# EAGLE design Comm_FM (EAGLE 5.11)

## Sheet 1 of 4
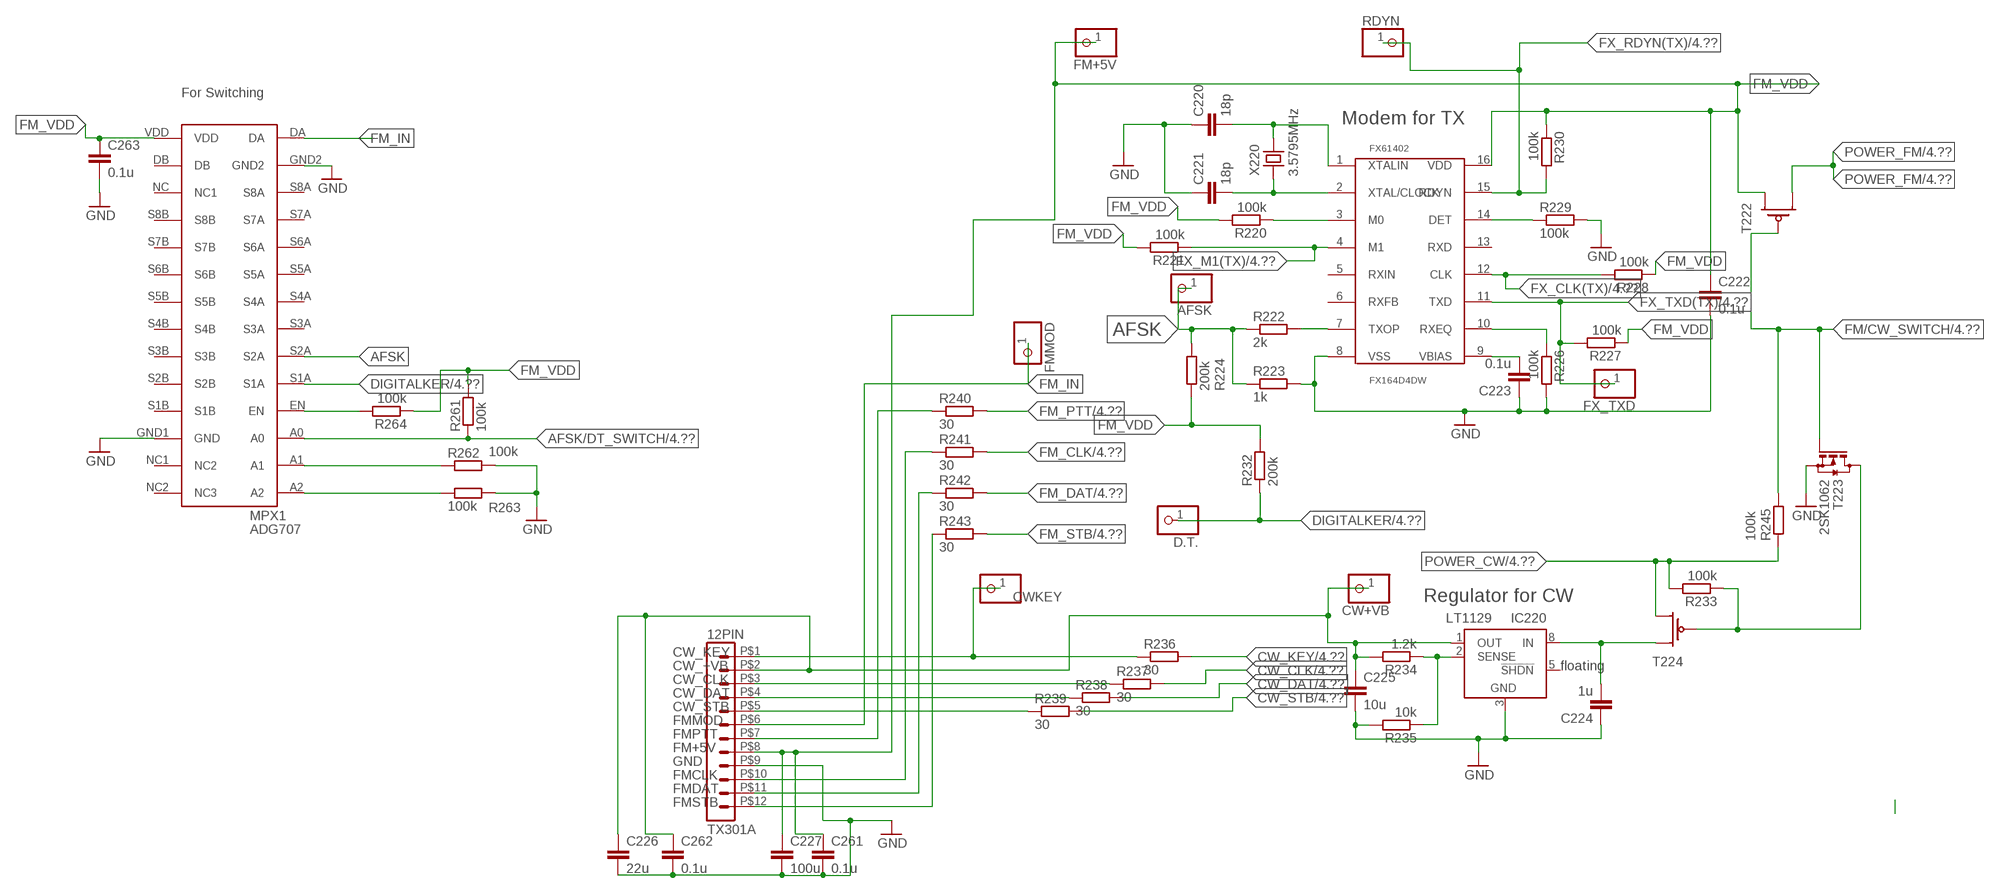
[diagram p0: schematic, sheet 1]

### Parts
AFSK  PINHD-1X1  [1X01]
C220  18p  C-EUC0603  [C0603]
C221  18p  C-EUC0603  [C0603]
C222  0.1u  C-EUC0603  [C0603]
C223  0.1u  C-EUC0603  [C0603]
C224  1u  C-EUC0603  [C0603]
C225  10u  C-EUC0603  [C0603]
C226  22u  C-EUC3225  [C3225]
C227  100u  C-EUC3225  [C3225]
C261  0.1u  C-EUC0603  [C0603]
C262  0.1u  C-EUC0603  [C0603]
C263  0.1u  C-EUC0603  [C0603]
CW+VB  PINHD-1X1  [1X01]
CWKEY  PINHD-1X1  [1X01]
D.T.  PINHD-1X1  [1X01]
FM+5V  PINHD-1X1  [1X01]
FMMOD  PINHD-1X1  [1X01]
FX61402  FX164D4DW  [SO16W]
FX_TXD  PINHD-1X1  [1X01]
IC220  LT1129  LT1129CS8  [SOIC8]
MPX1  ADG707  [ADG707]
R220  100k  R-EU_R0603  [R0603]
R221  100k  R-EU_R0603  [R0603]
R222  2k  R-EU_R0603  [R0603]
R223  1k  R-EU_R0603  [R0603]
R224  200k  R-EU_R0603  [R0603]
R226  100k  R-EU_R0603  [R0603]
R227  100k  R-EU_R0603  [R0603]
R228  100k  R-EU_R0603  [R0603]
R229  100k  R-EU_R0603  [R0603]
R230  100k  R-EU_R0603  [R0603]
R232  200k  R-EU_R0603  [R0603]
R233  100k  R-EU_R0603  [R0603]
R234  1.2k  R-EU_R0603  [R0603]
R235  10k  R-EU_R0603  [R0603]
R236  30  R-EU_R0603  [R0603]
R237  30  R-EU_R0603  [R0603]
R238  30  R-EU_R0603  [R0603]
R239  30  R-EU_R0603  [R0603]
R240  30  R-EU_R0603  [R0603]
R241  30  R-EU_R0603  [R0603]
R242  30  R-EU_R0603  [R0603]
R243  30  R-EU_R0603  [R0603]
R245  100k  R-EU_R0603  [R0603]
R261  100k  R-EU_R0603  [R0603]
R262  100k  R-EU_R0603  [R0603]
R263  100k  R-EU_R0603  [R0603]
R264  100k  R-EU_R0603  [R0603]
RDYN  PINHD-1X1  [1X01]
T222  2SJ377  [2SJ377]
T223  2SK1062  BSS123  [SOT23]
T224  2SJ377  [2SJ377]
TX301A  12PIN  [12PIN]
X220  3.5795MHz  XTAL49S  [HC49/S]

### Nets
AFSK: AFSK.1 MPX1.S2A R222.1 R223.1 R224.2
AFSK/DT_SWITCH: MPX1.A0 R261.1 ; also sheet 4
CW_CLK: R237.2 ; also sheet 4
CW_DAT: R238.2 ; also sheet 4
CW_KEY: R236.2 ; also sheet 4
CW_STB: R239.2 ; also sheet 4
DIGITALKER: D.T..1 MPX1.S1A R232.1 ; also sheet 4
FM/CW_SWITCH: R245.2 T222.G T223.1(G) ; also sheet 4
FM_CLK: R241.2 ; also sheet 4
FM_DAT: R242.2 ; also sheet 4
FM_IN: FMMOD.1 MPX1.DA TX301A.P$6
FM_PTT: R240.2 ; also sheet 4
FM_STB: R243.2 ; also sheet 4
FM_VDD: C222.1 C227.1 C261.1 C263.1 FM+5V.1 FX61402.16(VDD) MPX1.VDD R220.2 R221.2 R224.1 R227.1 R228.1 R230.1 R232.2 R261.2 R264.1 T222.D TX301A.P$8
FX_CLK(TX): FX61402.12(CLK) R228.2 ; also sheet 4
FX_M1(TX): FX61402.4(M1) R221.1 ; also sheet 4
FX_RDYN(TX): FX61402.15(RDYN) R230.2 RDYN.1 ; also sheet 4
FX_TXD(TX): FX61402.11(TXD) FX_TXD.1 R227.2 ; also sheet 4
GND: C220.1 C221.1 C222.2 C223.1 C224.1 C225.2 C226.2 C227.2 C261.2 C262.2 C263.2 FX61402.8(VSS) IC220.3(GND) MPX1.GND1(GND) MPX1.GND2 R223.2 R226.2 R229.2 R235.2 R262.2 R263.2 T223.2(S) TX301A.P$9 ; also sheet 2,3,4
N$6: C220.2 FX61402.1(XTALIN) X220.2
N$8: C221.2 FX61402.2(XTAL/CLOCK) X220.1
N$10: R242.1 TX301A.P$11
N$12: FX61402.7(TXOP) R222.2
N$18: R240.1 TX301A.P$7
N$19: MPX1.A2 R263.1
N$20: R243.1 TX301A.P$12
N$21: R241.1 TX301A.P$10
N$22: C223.2 FX61402.9(VBIAS)
N$26: FX61402.10(RXEQ) R226.1
N$27: FX61402.3(M0) R220.1
N$28: FX61402.14(DET) R229.1
N$36: MPX1.A1 R262.1
N$37: MPX1.EN R264.2
N$38: R233.1 T223.3(D) T224.G
N$39: C224.2 IC220.8(IN) T224.D
N$40: IC220.2(SENSE) R234.1 R235.1
N$43: CWKEY.1 R236.1 TX301A.P$1
N$45: R237.1 TX301A.P$3
N$47: R238.1 TX301A.P$4
N$49: R239.1 TX301A.P$5
N$51: C225.1 C226.1 C262.1 CW+VB.1 IC220.1(OUT) R234.2 TX301A.P$2
POWER_CW: R233.2 R245.1 T224.S ; also sheet 4
POWER_FM: T222.S ; also sheet 4
Unconnected: FX61402.5(RXIN) FX61402.6(RXFB) FX61402.13(RXD) IC220.4(NC) IC220.5(!SHDN) MPX1.DB MPX1.NC1(NC2) MPX1.NC2(NC3) MPX1.NC(NC1) MPX1.S1B MPX1.S2B MPX1.S3A MPX1.S3B MPX1.S4A MPX1.S4B MPX1.S5A MPX1.S5B MPX1.S6A MPX1.S6B MPX1.S7A MPX1.S7B MPX1.S8A MPX1.S8B

### Notes on the sheet
- For Switching
- Modem for TX
- Regulator for CW
- CW_KEY
- CW_+VB | floating
- CW_CLK
- CW_DAT
- CW_STB
- FMMOD
- FMPTT
- FM+5V
- GND
- FMCLK
- FMDAT
- FMSTB

## Sheet 2 of 4
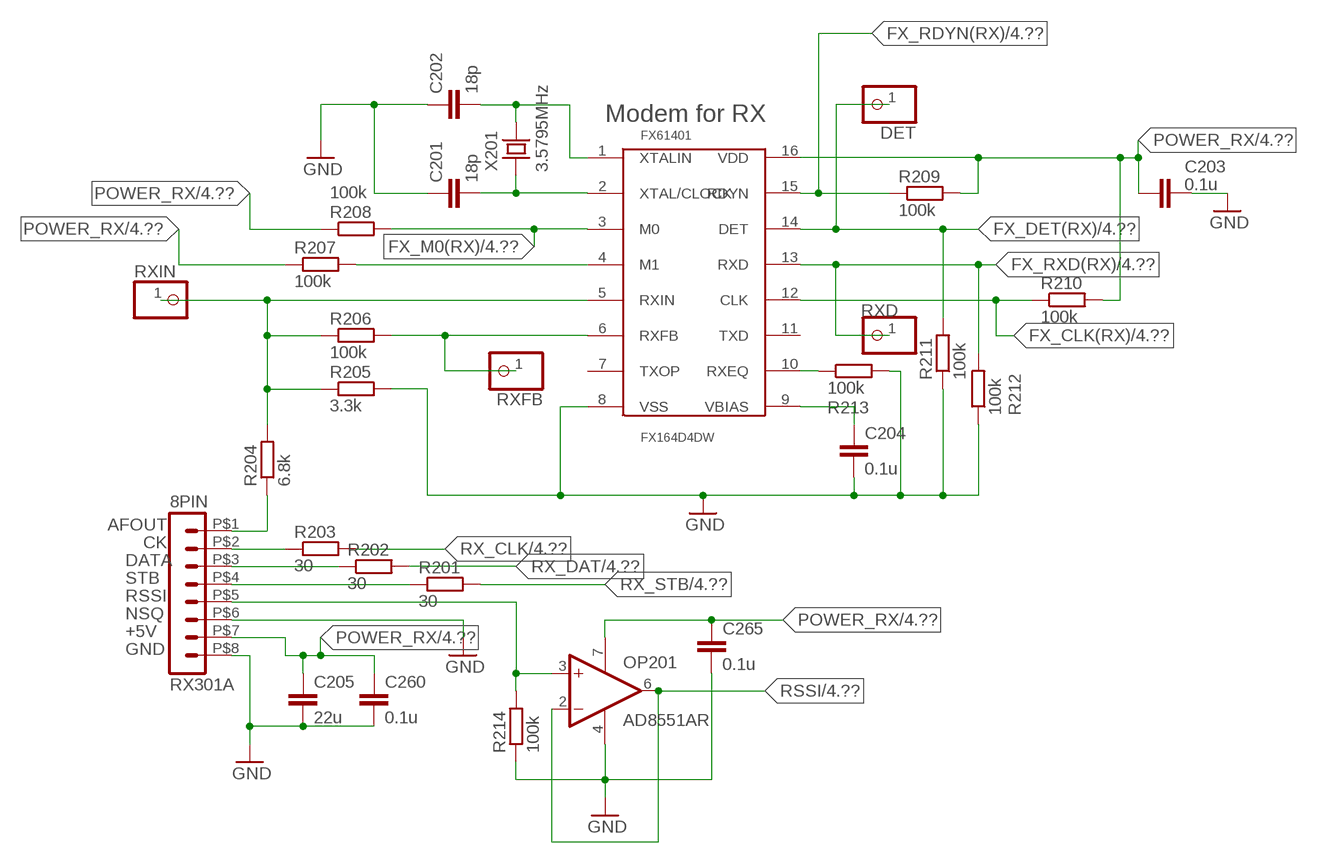
[diagram p1: schematic, sheet 2]

### Parts
C201  18p  C-EUC0603  [C0603]
C202  18p  C-EUC0603  [C0603]
C203  0.1u  C-EUC0603  [C0603]
C204  0.1u  C-EUC0603  [C0603]
C205  22u  C-EUC3225  [C3225]
C260  0.1u  C-EUC0603  [C0603]
C265  0.1u  C-EUC0603  [C0603]
DET  PINHD-1X1  [1X01]
FX61401  FX164D4DW  [SO16W]
OP201  AD8551AR  [SO8]
R201  30  R-EU_R0603  [R0603]
R202  30  R-EU_R0603  [R0603]
R203  30  R-EU_R0603  [R0603]
R204  6.8k  R-EU_R0603  [R0603]
R205  3.3k  R-EU_R0603  [R0603]
R206  100k  R-EU_R0603  [R0603]
R207  100k  R-EU_R0603  [R0603]
R208  100k  R-EU_R0603  [R0603]
R209  100k  R-EU_R0603  [R0603]
R210  100k  R-EU_R0603  [R0603]
R211  100k  R-EU_R0603  [R0603]
R212  100k  R-EU_R0603  [R0603]
R213  100k  R-EU_R0603  [R0603]
R214  100k  R-EU_R0603  [R0603]
RX301A  8PIN  [8PIN]
RXD  PINHD-1X1  [1X01]
RXFB  PINHD-1X1  [1X01]
RXIN  PINHD-1X1  [1X01]
X201  3.5795MHz  XTAL49S  [HC49/S]

### Nets
FX_CLK(RX): FX61401.12(CLK) R210.1 ; also sheet 4
FX_DET(RX): DET.1 FX61401.14(DET) R211.2 ; also sheet 4
FX_M0(RX): FX61401.3(M0) R208.2 ; also sheet 4
FX_RDYN(RX): FX61401.15(RDYN) R209.1 ; also sheet 4
FX_RXD(RX): FX61401.13(RXD) R212.2 RXD.1 ; also sheet 4
GND: C201.1 C202.1 C203.2 C204.2 C205.2 C260.2 C265.2 FX61401.8(VSS) OP201.4(GND) R205.2 R211.1 R212.1 R213.2 R214.1 RX301A.P$6 RX301A.P$8 ; also sheet 1,3,4
N$1: C201.2 FX61401.2(XTAL/CLOCK) X201.1
N$2: C202.2 FX61401.1(XTALIN) X201.2
N$3: C204.1 FX61401.9(VBIAS)
N$4: OP201.3(+IN) R214.2 RX301A.P$5
N$7: FX61401.6(RXFB) R206.2 RXFB.1
N$9: FX61401.4(M1) R207.2
N$11: R203.1 RX301A.P$2
N$13: R202.1 RX301A.P$3
N$14: R201.1 RX301A.P$4
N$23: FX61401.5(RXIN) R204.2 R205.1 R206.1 RXIN.1
N$24: R204.1 RX301A.P$1
N$29: FX61401.10(RXEQ) R213.1
POWER_RX: C203.1 C205.1 C260.1 C265.1 FX61401.16(VDD) OP201.7(V+) R207.1 R208.1 R209.2 R210.2 RX301A.P$7 ; also sheet 4
RSSI: OP201.2(-IN) OP201.6(OUT) ; also sheet 4
RX_CLK: R203.2 ; also sheet 4
RX_DAT: R202.2 ; also sheet 4
RX_STB: R201.2 ; also sheet 4
Unconnected: FX61401.7(TXOP) FX61401.11(TXD)

### Notes on the sheet
- Modem for RX
- AFOUT
- CK
- DATA
- STB
- RSSI
- NSQ
- +5V
- GND

## Sheet 3 of 4
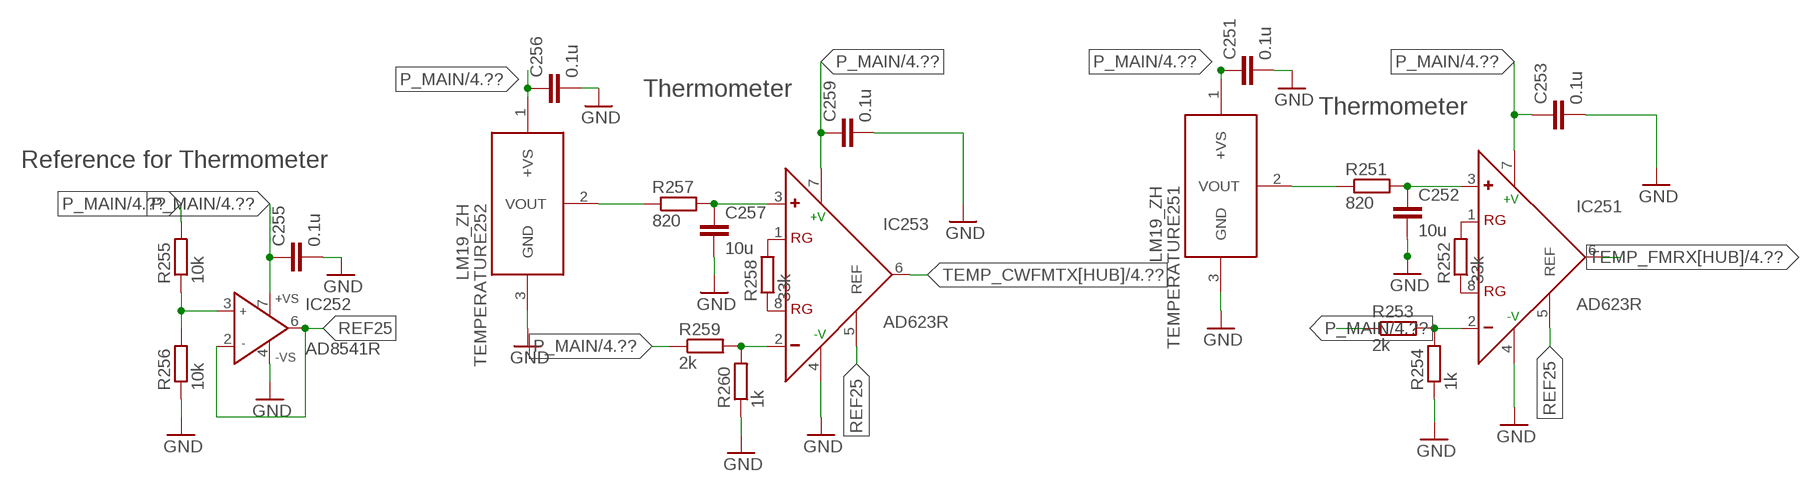
[diagram p2: schematic, sheet 3]

### Parts
C251  0.1u  C-EUC0603  [C0603]
C252  10u  C-EUC0603  [C0603]
C253  0.1u  C-EUC0603  [C0603]
C255  0.1u  C-EUC0603  [C0603]
C256  0.1u  C-EUC0603  [C0603]
C257  10u  C-EUC0603  [C0603]
C259  0.1u  C-EUC0603  [C0603]
IC251  AD623R  [SO8]
IC252  AD8541R  [SO8]
IC253  AD623R  [SO8]
R251  820  R-EU_R0402  [R0402]
R252  33k  R-EU_R0603  [R0603]
R253  2k  R-EU_R0603  [R0603]
R254  1k  R-EU_R0603  [R0603]
R255  10k  R-EU_R0603  [R0603]
R256  10k  R-EU_R0603  [R0603]
R257  820  R-EU_R0603  [R0603]
R258  33k  R-EU_R0603  [R0603]
R259  2k  R-EU_R0603  [R0603]
R260  1k  R-EU_R0603  [R0603]
TEMPERATURE251  LM19_ZH  [LM19_XH]
TEMPERATURE252  LM19_ZH  [LM19_XH]

### Nets
GND: C251.2 C252.2 C253.2 C255.2 C256.2 C257.2 C259.2 IC251.4(-V) IC252.4(-VS) IC253.4(-V) R254.1 R256.1 R260.1 TEMPERATURE251.3(GND) TEMPERATURE252.3(GND) ; also sheet 1,2,4
N$30: IC252.3(IN+) R255.1 R256.2
N$31: C257.1 IC253.3(+) R257.2
N$32: IC253.1(RG) R258.2
N$33: IC253.8(RG) R258.1
N$34: R257.1 TEMPERATURE252.2(VOUT)
N$35: IC253.2(-) R259.2 R260.2
N$55: C252.1 IC251.3(+) R251.2
N$56: IC251.1(RG) R252.2
N$57: IC251.8(RG) R252.1
N$58: R251.1 TEMPERATURE251.2(VOUT)
N$59: IC251.2(-) R253.2 R254.2
P_MAIN: C251.1 C253.1 C255.1 C256.1 C259.1 IC251.7(+V) IC252.7(+VS) IC253.7(+V) R253.1 R255.2 R259.1 TEMPERATURE251.1(+VS) TEMPERATURE252.1(+VS) ; also sheet 1,4
REF25: IC251.5(REF) IC252.2(IN-) IC252.6(OUT) IC253.5(REF)
TEMP_CWFMTX[HUB]: IC253.6(OUT) ; also sheet 4
TEMP_FMRX[HUB]: IC251.6(OUT) ; also sheet 4

### Notes on the sheet
- Thermometer
- Thermometer
- Reference for Thermometer

## Sheet 4 of 4
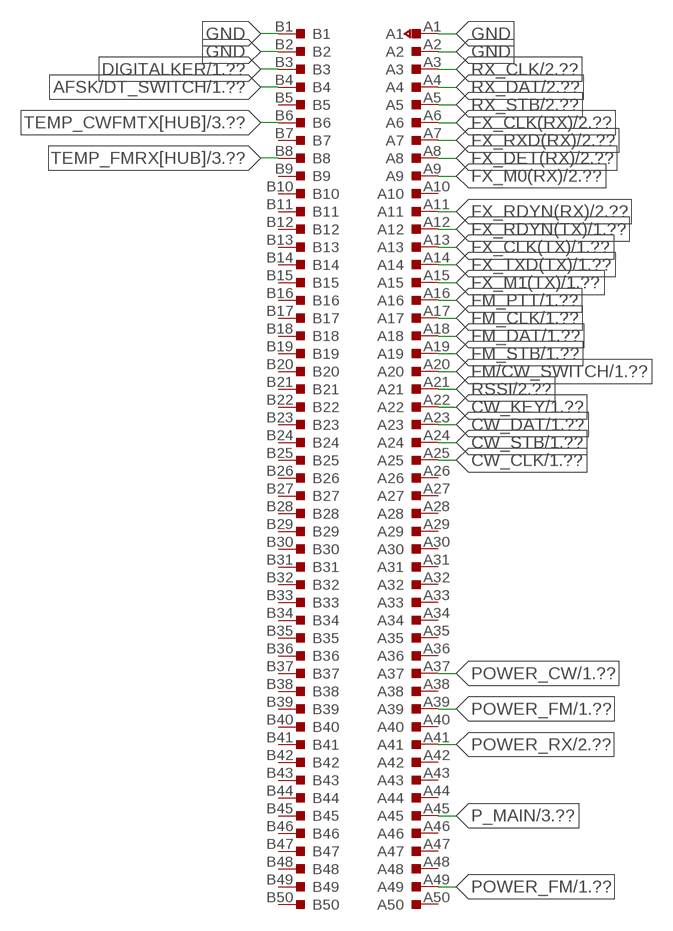
[diagram p3: schematic, sheet 4]

### Parts
HCONC  XH3A-0141-A_NEW  [XH3A-0141-A]

### Nets
AFSK/DT_SWITCH: HCONC.B4 ; also sheet 1
CW_CLK: HCONC.A25 ; also sheet 1
CW_DAT: HCONC.A23 ; also sheet 1
CW_KEY: HCONC.A22 ; also sheet 1
CW_STB: HCONC.A24 ; also sheet 1
DIGITALKER: HCONC.B3 ; also sheet 1
FM/CW_SWITCH: HCONC.A20 ; also sheet 1
FM_CLK: HCONC.A17 ; also sheet 1
FM_DAT: HCONC.A18 ; also sheet 1
FM_PTT: HCONC.A16 ; also sheet 1
FM_STB: HCONC.A19 ; also sheet 1
FX_CLK(RX): HCONC.A6 ; also sheet 2
FX_CLK(TX): HCONC.A13 ; also sheet 1
FX_DET(RX): HCONC.A8 ; also sheet 2
FX_M0(RX): HCONC.A9 ; also sheet 2
FX_M1(TX): HCONC.A15 ; also sheet 1
FX_RDYN(RX): HCONC.A11 ; also sheet 2
FX_RDYN(TX): HCONC.A12 ; also sheet 1
FX_RXD(RX): HCONC.A7 ; also sheet 2
FX_TXD(TX): HCONC.A14 ; also sheet 1
GND: HCONC.A1 HCONC.A2 HCONC.B1 HCONC.B2 ; also sheet 1,2,3
P_MAIN: HCONC.A45 ; also sheet 1,3
POWER_CW: HCONC.A37 ; also sheet 1
POWER_FM: HCONC.A39 HCONC.A49 ; also sheet 1
POWER_RX: HCONC.A41 ; also sheet 2
RSSI: HCONC.A21 ; also sheet 2
RX_CLK: HCONC.A3 ; also sheet 2
RX_DAT: HCONC.A4 ; also sheet 2
RX_STB: HCONC.A5 ; also sheet 2
TEMP_CWFMTX[HUB]: HCONC.B6 ; also sheet 3
TEMP_FMRX[HUB]: HCONC.B8 ; also sheet 3
Unconnected: HCONC.A10 HCONC.A26 HCONC.A27 HCONC.A28 HCONC.A29 HCONC.A30 HCONC.A31 HCONC.A32 HCONC.A33 HCONC.A34 HCONC.A35 HCONC.A36 HCONC.A38 HCONC.A40 HCONC.A42 HCONC.A43 HCONC.A44 HCONC.A46 HCONC.A47 HCONC.A48 HCONC.A50 HCONC.B5 HCONC.B7 HCONC.B9 HCONC.B10 HCONC.B11 HCONC.B12 HCONC.B13 HCONC.B14 HCONC.B15 HCONC.B16 HCONC.B17 HCONC.B18 HCONC.B19 HCONC.B20 HCONC.B21 HCONC.B22 HCONC.B23 HCONC.B24 HCONC.B25 HCONC.B26 HCONC.B27 HCONC.B28 HCONC.B29 HCONC.B30 HCONC.B31 HCONC.B32 HCONC.B33 HCONC.B34 HCONC.B35 HCONC.B36 HCONC.B37 HCONC.B38 HCONC.B39 HCONC.B40 HCONC.B41 HCONC.B42 HCONC.B43 HCONC.B44 HCONC.B45 HCONC.B46 HCONC.B47 HCONC.B48 HCONC.B49 HCONC.B50

## Power pins joined to a net without a drawn wire
GND: IC220.6(GND) IC220.7(GND)

## Library data of the parts
AFSK CW+VB CWKEY D.T. DET FM+5V FMMOD FX_TXD RDYN RXD RXFB RXIN = pinhead:PINHD-1X1: PIN HEADER
C201-C205 C220-C227 C251-C253 C255-C257 C259-C263 C265 = rcl:C-EU: CAPACITOR, European symbol
FX61401 FX61402 = FX614_tPlace:FX164D4: FX614D4 Bell 202 Comatible Modem
HCONC = habconector20120702:XH3A-0141-A_NEW: OMRON HabConnector XH3A-0141-A 2012-07-02 OMRON HabConnector XH3B-0141-A 2012-07-02
IC220 = linear-technology:LT1129CS8: VOLTAGE REGULATOR with shutdown
IC251 IC253 = analog-devices:AD623: Single-Supply, Rail-to-Rail, Low Cost Instrumentation Amplifier Source: http://www.analog.com/static/imported-files/data_sheets/AD623.pdf; MPN: AD623ARZ.; OC_FARNELL: 9426213; OC_NEWARK: 31M4186
IC252 = analog-devices:AD8541: General-Purpose CMOS Rail-to-Rail Amplifiers Source: http://www.analog.com/static/imported-files/data_sheets/AD8541_8542_8544.pdf; MPN: AD8541ARZ; OC_FARNELL: 9603859; OC_NEWARK: 31M4547
MPX1 = ADG707:ADG707
OP201 = analog-devices (2):AD8551*: 1x Operational Amplifiers, Zero-Drift, Single-Supply, Rail-to-Rail Input/Output
R201-R214 R220-R224 R226-R230 R232-R243 R245 R252-R264 = rcl:R-EU_: RESISTOR, European symbol
R251 = resistor:R-EU_: RESISTOR, European symbol
RX301A = pins_for_tranceiver:8PIN
T222 T224 = 03_Amp:2SJ377: P-MOS FET for ARTSAT
T223 = transistor-small-signal:BSS123: N-CHANNEL MOS FET
TEMPERATURE251 TEMPERATURE252 = LM19_ZH:LM19_ZH: LM19 + Connector(JST XH)
TX301A = pins_for_tranceiver:12PIN
X201 X220 = MyLib:XTAL: Crystal Oscillator HC49U/S

## Board
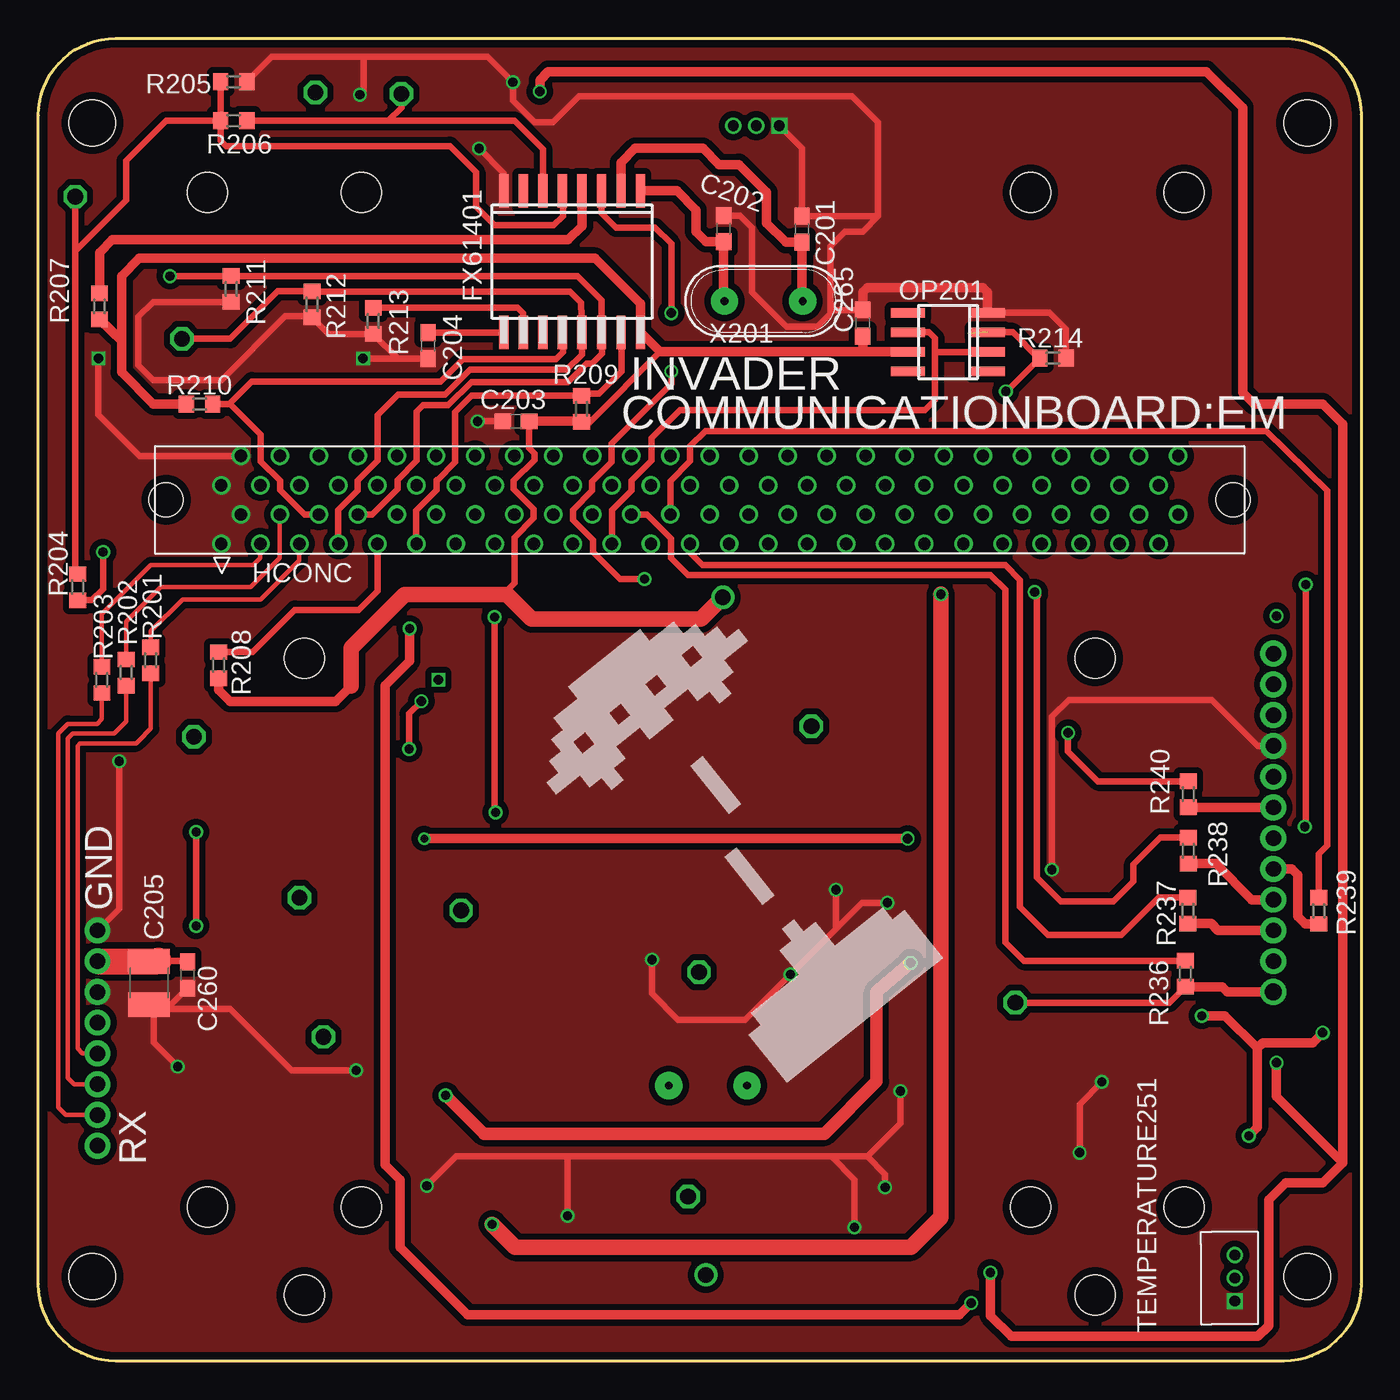
[diagram p4: board, top side]
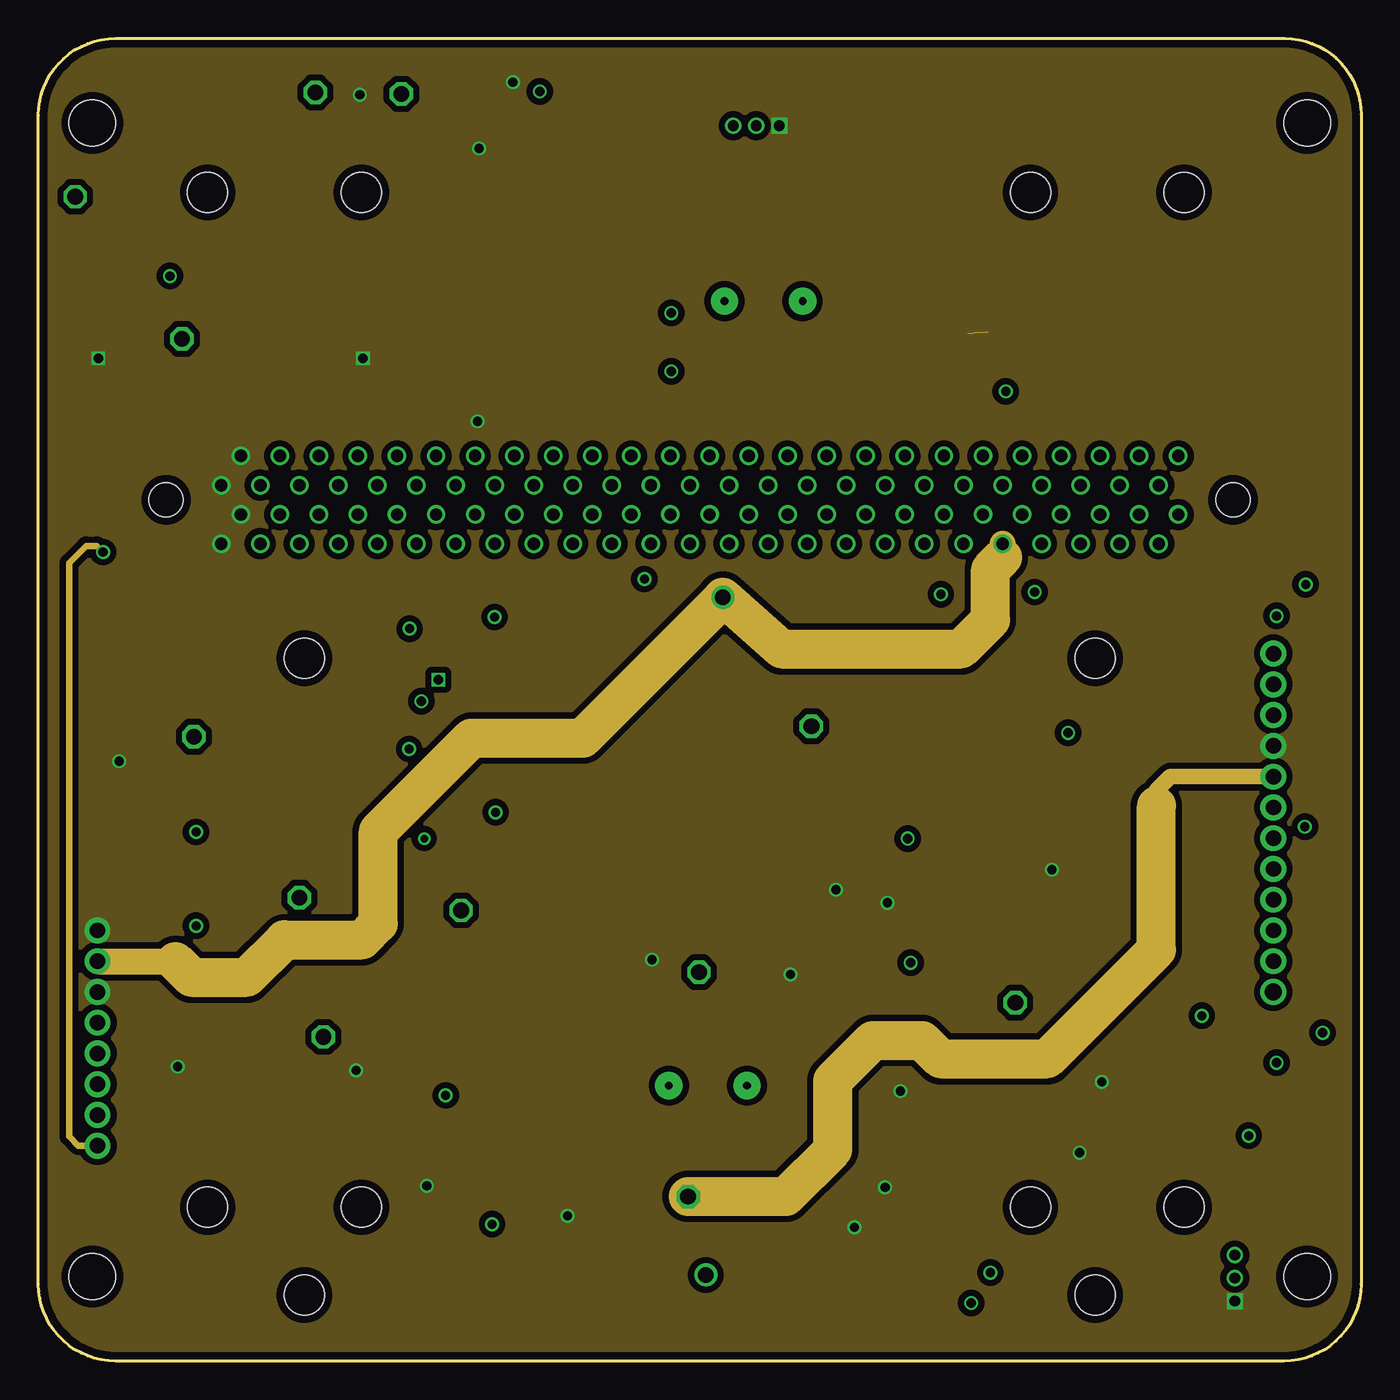
[diagram p5: board, inner layer Route2]
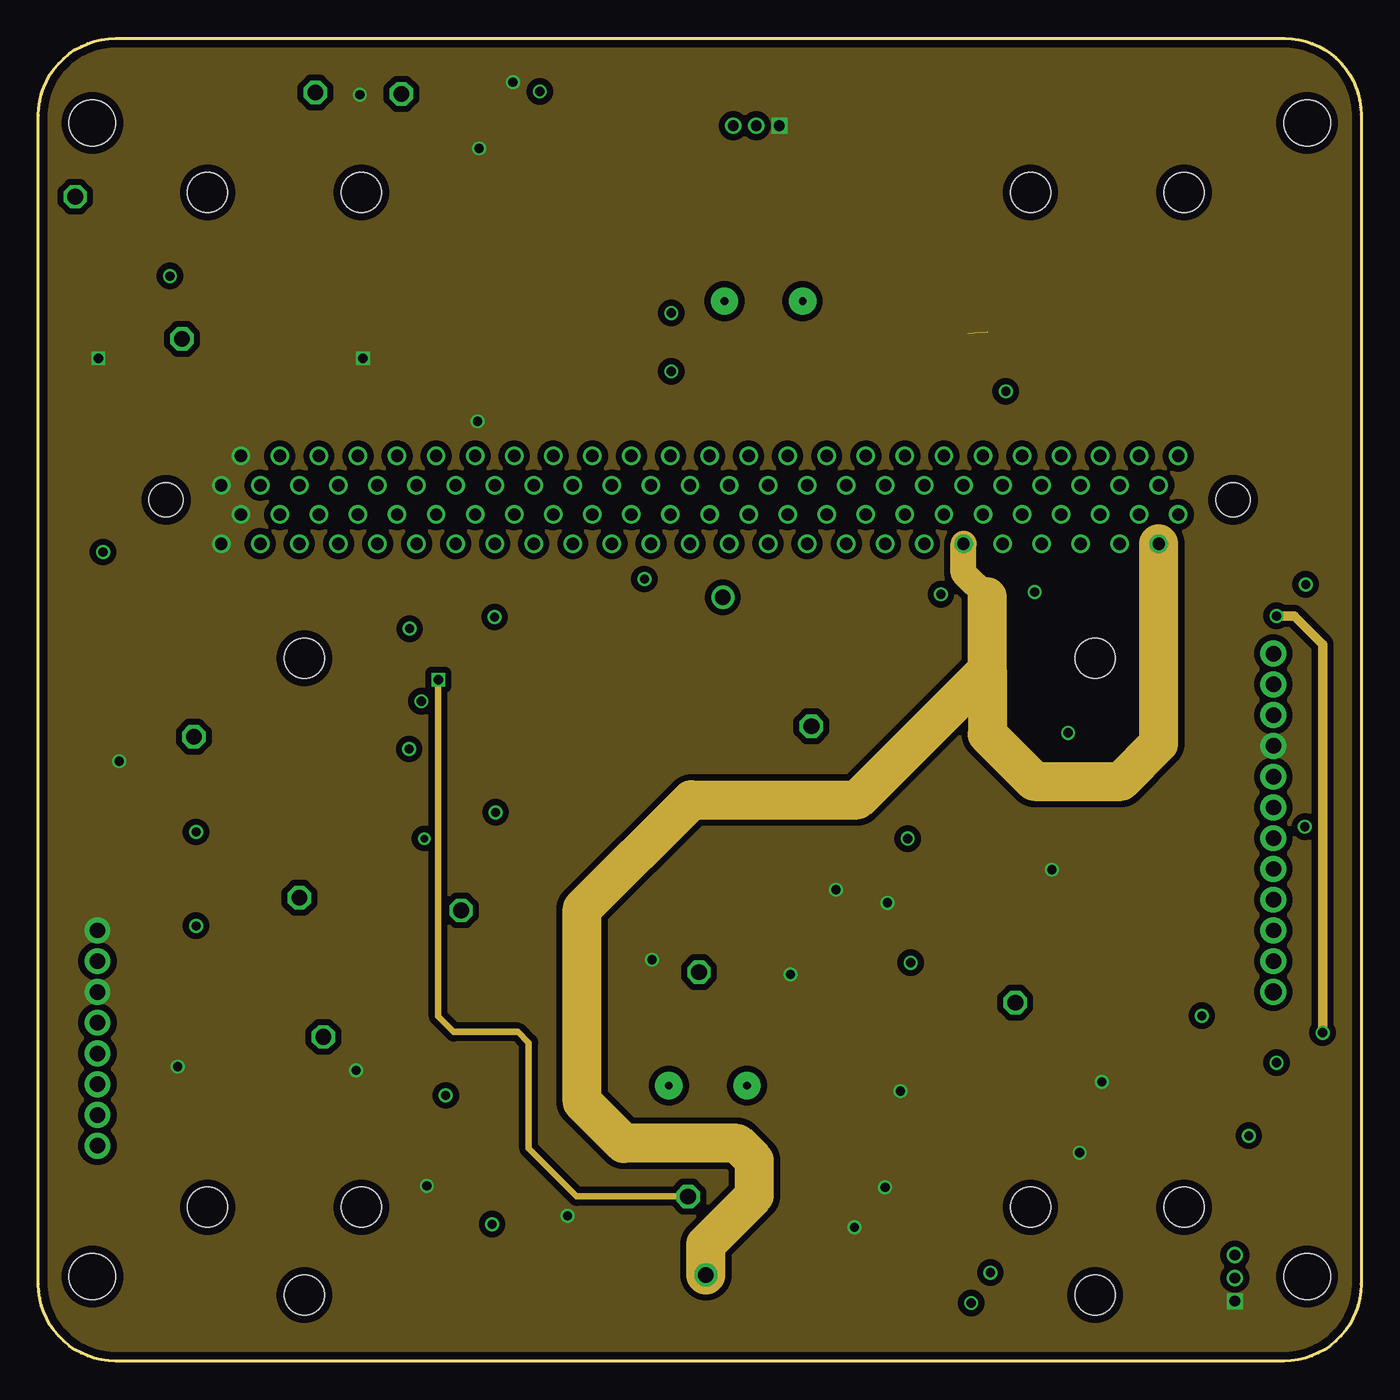
[diagram p6: board, inner layer Route15]
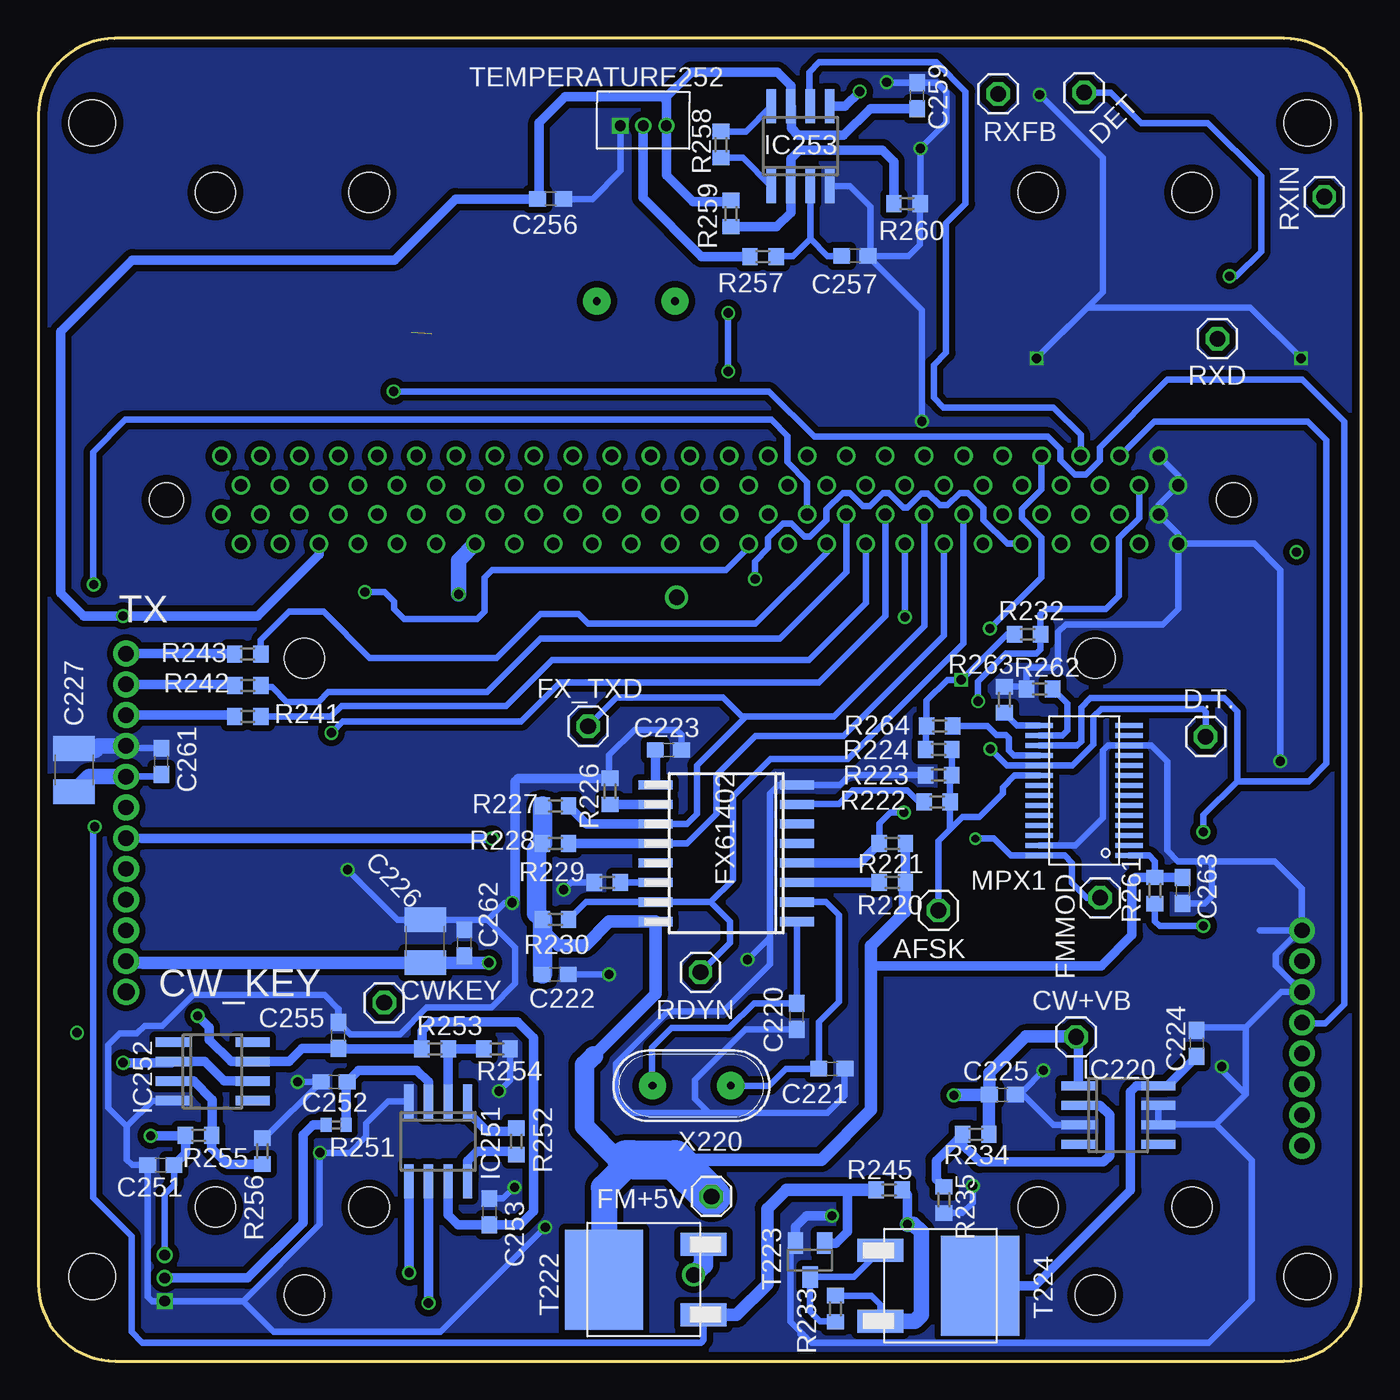
[diagram p7: board, bottom side, seen from below]

Size 86 x 86 mm. Coordinates in mm from the lower left corner, seen from the top.
Outline: 5,86 81.05,86 arc-90 86,81.05 86,5 arc-90 81,0 5,0 arc-90 0,5 0,81 arc-90 5,86
Copper layers (1+2*15+16): Top 0.018mm / dielectric 0.25mm / Route2 0.035mm / dielectric 1mm / Route15 0.035mm / dielectric 0.25mm / Bottom 0.018mm
Design rules "pban_5mil-l4": minimum track width 5mil, minimum drill 0.3mm, track to track 5mil, track to pad 0.229mm, pad to pad 5mil, via to via 5mil, smd to smd 5mil, copper to edge 0.5mm, drill to drill 0.5mm, minimum pad ring 0.15mm, minimum via ring 0.15mm, stop-mask expansion 4mil, vias tented up to drill 0.35mm, thermal gap 10mil
Holes 3 mm at 3.5,5.5 82.5,5.5 82.5,80.5 3.5,80.5
Holes 2.6 mm at 74.5,10 74.5,76 11,10 11,76 17.3,4.3 68.7,4.3 17.3,45.7 68.7,45.7 21,10 64.5,10 21,76 64.5,76
tKeepout: area 17.5,5.5 to 75.9,56.3
vRestrict: area 17.5,5.5 to 75.9,91.9

### Footprints (pad centres in the part's own frame; a part is rotated, then mirrored left to right if it is on the bottom)
1X01 = drill 1.016 octagon: 1 0,0
C0603 = smd 1.1 x 1: 1 -0.85,0; 2 0.85,0
C3225 = smd 1.6 x 2.7: 1 -1.4,0; 2 1.4,0
SO16W = smd 0.6 x 2.2: 1 -4.445,-4.6; 2 -3.175,-4.6; 3 -1.905,-4.6; 4 -0.635,-4.6; 5 0.635,-4.6; 6 1.905,-4.6; 7 3.175,-4.6; 8 4.445,-4.6; 9 4.445,4.6; 10 3.175,4.6; 11 1.905,4.6; 12 0.635,4.6; 13 -0.635,4.6; 14 -1.905,4.6; 15 -3.175,4.6; 16 -4.445,4.6
XH3A-0141-A = drill 0.8 round: A1 -31.115,-2.857; A2 -29.845,-0.953; A3 -28.575,-2.857; A4 -27.305,-0.953; A5 -26.035,-2.857; A6 -24.765,-0.953; A7 -23.495,-2.857; A8 -22.225,-0.953; A9 -20.955,-2.857; A10 -19.685,-0.953; A11 -18.415,-2.857; A12 -17.145,-0.953; A13 -15.875,-2.857; A14 -14.605,-0.953; A15 -13.335,-2.857; A16 -12.065,-0.953; A17 -10.795,-2.857; A18 -9.525,-0.953; A19 -8.255,-2.857; A20 -6.985,-0.953; A21 -5.715,-2.857; A22 -4.445,-0.953; A23 -3.175,-2.857; A24 -1.905,-0.953; A25 -0.635,-2.857; A26 0.635,-0.953; A27 1.905,-2.857; A28 3.175,-0.953; A29 4.445,-2.857; A30 5.715,-0.953; A31 6.985,-2.857; A32 8.255,-0.953; A33 9.525,-2.857; A34 10.795,-0.953; A35 12.065,-2.857; A36 13.335,-0.953; A37 14.605,-2.857; A38 15.875,-0.953; A39 17.145,-2.857; A40 18.415,-0.953; A41 19.685,-2.857; A42 20.955,-0.953; A43 22.225,-2.857; A44 23.495,-0.953; A45 24.765,-2.857; A46 26.035,-0.953; A47 27.305,-2.857; A48 28.575,-0.953; A49 29.845,-2.857; A50 31.115,-0.953; B1 -31.115,0.953; B2 -29.845,2.857; B3 -28.575,0.953; B4 -27.305,2.857; B5 -26.035,0.953; B6 -24.765,2.857; B7 -23.495,0.953; B8 -22.225,2.857; B9 -20.955,0.953; B10 -19.685,2.857; B11 -18.415,0.953; B12 -17.145,2.857; B13 -15.875,0.953; B14 -14.605,2.857; B15 -13.335,0.953; B16 -12.065,2.857; B17 -10.795,0.953; B18 -9.525,2.857; B19 -8.255,0.953; B20 -6.985,2.857; B21 -5.715,0.953; B22 -4.445,2.857; B23 -3.175,0.953; B24 -1.905,2.857; B25 -0.635,0.953; B26 0.635,2.857; B27 1.905,0.953; B28 3.175,2.857; B29 4.445,0.953; B30 5.715,2.857; B31 6.985,0.953; B32 8.255,2.857; B33 9.525,0.953; B34 10.795,2.857; B35 12.065,0.953; B36 13.335,2.857; B37 14.605,0.953; B38 15.875,2.857; B39 17.145,0.953; B40 18.415,2.857; B41 19.685,0.953; B42 20.955,2.857; B43 22.225,0.953; B44 23.495,2.857; B45 24.765,0.953; B46 26.035,2.857; B47 27.305,0.953; B48 28.575,2.857; B49 29.845,0.953; B50 31.115,2.857 | hole 2.2: -34.7,0; 34.67,0
SOIC8 = smd 0.6 x 2.2: 1 -1.905,-2.6; 2 -0.635,-2.6; 3 0.635,-2.6; 4 1.905,-2.6; 5 1.905,2.6; 6 0.635,2.6; 7 -0.635,2.6; 8 -1.905,2.6
SO8 = smd 0.6 x 2.2: 1 -1.905,-2.6; 2 -0.635,-2.6; 3 0.635,-2.6; 4 1.905,-2.6; 5 1.905,2.6; 6 0.635,2.6; 7 -0.635,2.6; 8 -1.905,2.6
ADG707 = smd 1.8 x 0.3: A0 2.925,-2.925; A1 2.925,-3.575; A2 2.925,-4.225; DA 2.925,4.225; DB -2.925,3.575; EN 2.925,-2.275; GND1 -2.925,-2.925; GND2 2.925,3.575; NC -2.925,-3.575; NC1 -2.925,2.925; NC2 -2.925,-4.225; S1A 2.925,-1.625; S1B -2.925,-2.275; S2A 2.925,-0.975; S2B -2.925,-1.625; S3A 2.925,-0.325; S3B -2.925,-0.975; S4A 2.925,0.325; S4B -2.925,-0.325; S5A 2.925,0.975; S5B -2.925,0.325; S6A 2.925,1.625; S6B -2.925,0.975; S7A 2.925,2.275; S7B -2.925,1.625; S8A 2.925,2.925; S8B -2.925,2.275; VDD -2.925,4.225
R0603 = smd 1 x 1.1: 1 -0.85,0; 2 0.85,0
R0402 = smd 0.7 x 0.9: 1 -0.65,0; 2 0.65,0
8PIN = drill 1 pad 1.676 round: P$1 0,0; P$2 2,0; P$3 4,0; P$4 6,0; P$5 8,0; P$6 10,0; P$7 12,0; P$8 14,0
2SJ377 = smd 6.5 x 5.08: D 0,-1.27 | smd 1.5 x 3: G -2.3,-7.75; S 2.3,-7.75
SOT23 = smd 1 x 1.4: 1 -0.95,-1.1; 2 0.95,-1.1; 3 0,1.1
LM19_XH = drill 0.7 round: 1 -1.5,0; 2 0,0 | drill 0.7 square: 3 1.5,0
12PIN = drill 1.1 pad 1.676 round: P$1 0,0 | drill 1 pad 1.676 round: P$2 2,0; P$3 4,0; P$4 6,0; P$5 8,0; P$6 10,0; P$7 12,0; P$8 14,0; P$9 16,0; P$10 18,0; P$11 20,0; P$12 22,0
HC49/S = drill 0.5 pad 1.778 round: 1 -2.54,0; 2 2.54,0

### Placement (x,y rotation side)
AFSK  27.48,29.3 0 bottom
C201  49.65,73.59 270 top
C202  44.55,73.63 270 top
C203  31.05,61.11 180 top
C204  25.34,66.03 270 top
C205  7.2,24.59 270 top
C220  36.69,22.41 90 bottom
C221  34.41,19.02 180 bottom
C222  52.4,25.14 0 bottom
C223  45.05,39.74 180 bottom
C224  10.69,20.65 270 bottom
C225  23.32,17.31 0 bottom
C226  60.85,27.3 90 bottom
C227  83.68,38.43 90 bottom
C251  78.04,12.75 180 bottom
C252  66.77,18.16 180 bottom
C253  56.67,9.72 90 bottom
C255  66.5,21.17 90 bottom
C256  52.7,75.56 0 bottom
C257  32.92,71.86 0 bottom
C259  28.86,82.28 90 bottom
C260  9.7,25.1 270 top
C261  78,39 90 bottom
C262  58.3,27.2 90 bottom
C263  11.6,30.6 270 bottom
C265  53.6,67.5 90 top
CW+VB  18.53,21.08 0 bottom
CWKEY  63.52,23.3 0 bottom
D.T.  10.1,40.6 0 bottom
DET  18.01,82.48 0 bottom
FM+5V  42.24,10.7 0 bottom
FMMOD  16.96,30.12 0 bottom
FX61401  34.7,71.49 180 top
FX61402  41.27,33.02 90 bottom
FX_TXD  50.26,41.28 0 bottom
HCONC  43,56 0 top
IC220  15.79,15.99 270 bottom
IC251  60.01,14.29 180 bottom
IC252  74.67,18.84 270 bottom
IC253  36.45,78.99 0 bottom
MPX1  18,37.1 180 bottom
OP201  59.14,66.26 90 top
R201  7.3,45.56 90 top
R202  5.71,44.77 90 top
R203  4.13,44.29 90 top
R204  2.54,50.32 90 top
R205  12.7,83.19 0 top
R206  12.7,80.64 0 top
R207  3.97,68.58 90 top
R208  11.73,45.26 90 top
R209  35.33,61.92 270 top
R210  10.48,62.23 180 top
R211  12.53,69.71 90 top
R212  17.8,68.71 90 top
R213  21.77,67.63 270 top
R214  65.97,65.22 180 top
R220  30.48,31.11 0 bottom
R221  30.48,33.66 0 bottom
R222  27.57,36.36 180 bottom
R223  27.47,38.09 180 bottom
R224  27.46,39.78 0 bottom
R226  48.84,37.05 90 bottom
R227  52.38,36.11 0 bottom
R228  52.38,33.64 0 bottom
R229  49.02,31.12 180 bottom
R230  52.38,28.73 0 bottom
R232  21.69,47.26 180 bottom
R233  34.19,3.4 90 bottom
R234  25.05,14.74 0 bottom
R235  27.12,10.48 270 bottom
R236  74.58,25.18 90 top
R237  74.73,29.29 90 top
R238  74.78,33.19 90 top
R239  83.25,29.27 90 top
R240  74.78,36.85 90 top
R241  72.39,41.91 0 bottom
R242  72.37,43.93 0 bottom
R243  72.39,45.97 0 bottom
R245  30.68,11.13 180 bottom
R251  66.64,15.35 0 bottom
R252  54.93,14.29 90 bottom
R253  60.21,20.29 0 bottom
R254  56.18,20.3 180 bottom
R255  75.59,14.68 180 bottom
R256  71.44,13.65 270 bottom
R257  38.88,71.82 0 bottom
R258  41.62,79.09 270 bottom
R259  40.96,74.61 270 bottom
R260  29.53,75.25 180 bottom
R261  13.4,30.6 90 bottom
R262  20.9,43.7 180 bottom
R263  23.2,43 90 bottom
R264  27.4,41.3 0 bottom
RDYN  42.95,25.28 0 bottom
RX301A  3.84,14 90 top
RXD  9.34,66.47 0 bottom
RXFB  23.6,82.4 0 bottom
RXIN  2.39,75.71 0 bottom
T222  50.5,5.3 90 bottom
T223  35.83,6.56 180 bottom
T224  23.5,4.9 270 bottom
TEMPERATURE251  77.79,5.4 270 top
TEMPERATURE252  46.67,80.33 180 bottom
TX301A  80.3,24 90 top
X201  47.15,68.92 180 top
X220  43.53,17.91 180 bottom

### Tracks (layer width: path | path; a pad name or v marks a point on that pad's centre or on a via)
AFSK
  Bottom 0.406: MPX1.S2A 22.52,38.08 23.3,37.3 23.3,36.9 24.82,35.38 25.92,35.38 26.72,34.58 | AFSK.1 27.48,33.82 26.72,34.58 | 26.72,34.58 R222.1 26.72,37.99 R223.1 26.62,39.77 R224.2
AFSK/DT_SWITCH  (via drill 0.6)
  Top 0.406: v10.25,28.3 v10.25,34.4
  Bottom 0.406: 8.05,37.7 3.4,37.7 2.25,38.85 2.25,59.9 3.45,61.1 13.45,61.1 HCONC.B4 | v10.25,34.4 10.25,35.5 8.05,37.7 | MPX1.A0 18.48,40.02 18.2,40.3 18.2,42.5 17.6,43.1 8.9,43.1 8.05,42.25 8.05,37.7 | v10.25,28.3 13.1,28.3 13.4,28.6 R261.1
CW_CLK
  Top 0.406: HCONC.A25 42.37,52.57 43.18,51.75 62.87,51.75 63.82,50.8 63.82,29.53 65.65,27.7 70.4,27.7 72.84,30.14 R237.2
CW_DAT  (via drill 0.6)
  Top 0.406: 64.93,49.85 64.93,31.43 66.48,29.88 69.88,29.88 71.2,31.2 71.2,32.3 72.94,34.04 R238.2
  Top 0.61: v64.77,50.01 64.93,49.85
  Bottom 0.406: v64.77,50.01 63.5,50.01 62.87,49.37 62.87,48.9 62.23,48.26 57.47,48.26 56.99,48.74 56.99,50.96 56.52,51.44 41.28,51.44 39.83,52.89 HCONC.A23
CW_KEY
  Top 0.406: HCONC.A22 39.57,55.05 41.14,53.48 41.14,52.2 42.23,51.12 61.91,51.12 62.87,50.16 62.87,27.23 64.07,26.03 R236.2
CW_STB
  Top 0.406: HCONC.A24 41.09,57.23 42.38,58.52 42.38,59.48 43.36,60.46 79.84,60.46 83.8,56.6 83.8,33.52 83.25,32.98 R239.2
DIGITALKER  (via drill 0.6)
  Top 0.406: v24.9,42.9 24.1,42.1 v24.1,39.8
  Bottom 0.406: HCONC.B3 14.43,54.83 15.75,53.5 15.75,49.75 16.6,48.9 20.5,48.9 20.84,48.56 R232.1 20.84,46.26 21.1,46 23.1,46 24.9,44.2 v24.9,42.9 | D.T..1 10.1,42.2 10.3,42.4 16.9,42.4 17.4,41.9 17.4,40.1 18.77,38.73 MPX1.S1A 23.02,38.73 v24.1,39.8
FM/CW_SWITCH  (via drill 0.6)
  Top 0.406: v82.4,50.5 82.4,34.8 v82.35,34.75
  Bottom 0.406: HCONC.A20 36.02,57.16 37.3,58.45 37.3,60.15 38.35,61.2 80.35,61.2 82.45,59.1 82.45,50.55 v82.4,50.5 | v82.35,34.75 82.45,34.65 82.45,10.6 79.95,8.1 79.95,1.9 79.25,1.2 42.93,1.2 42.75,1.38 T222.G
  Bottom 0.61: T223.1 34.14,7.67 33.4,8.4 33.4,11.13
  Bottom 0.813: R245.2 33.4,11.13 37.37,11.13 38.6,9.9 38.6,5 40.6,3 T222.G
FM_CLK
  Bottom 0.406: HCONC.A17 32.2,49.3 35.9,45.6 52.6,45.6 55.6,42.6 66.3,42.6 67,41.9 R241.2
FM_DAT
  Bottom 0.406: 71.48,43.97 R242.2 71.41,43.81 70.8,43.81 69.85,42.86 67.79,42.86 67.15,43.5 56.83,43.5 53.34,46.99 37.78,46.99 33.48,51.3 HCONC.A18
FM_IN  (via drill 0.5, 0.6)
  Top 0.61: v25.08,33.97 v56.52,33.97
  Bottom 0.406: v25.08,33.97 23.87,33.97 22.77,32.88 MPX1.DA 19.27,32.88 18.8,32.4 18.8,31.1 17.82,30.12 FMMOD.1
  Bottom 0.61: v56.52,33.97 79.27,33.97 TX301A.P$6
FM_PTT  (via drill 0.6)
  Top 0.406: R240.2 68.9,37.7 66.95,39.65 v66.95,40.85
  Bottom 0.406: HCONC.A16 30.93,48.44 35.24,44.13 52.07,44.13 54.61,41.59 66.21,41.59 v66.95,40.85
FM_STB
  Bottom 0.406: R243.2 71.54,46.89 70.48,47.94 | 70.48,47.94 | 70.48,47.94 69.69,48.74 67.47,48.74 64.45,45.72 56.2,45.72 53.34,48.58 50.88,48.58 50.25,47.95 39.36,47.95 34.75,52.57 HCONC.A19
FM_VDD  (via drill 0.6)
  Route2 1.016: TX301A.P$8 73.6,38 72.7,37.1 72.7,36.1
  Route2 2.54: 72.7,36.1 72.7,26.75 65.6,19.65 58.65,19.65 57.45,20.85 54.25,20.85 51.65,18.25 51.65,13.75 48.6,10.7 FM+5V.1
  Route15 0.406: v26,44.3 26,22.4 27,21.4 31.18,21.4 31.88,20.7 31.88,13.82 35,10.7 FM+5V.1
  Bottom 0.406: C261.1 78.15,38 TX301A.P$8 | v26,44.3 26.02,44.3 | MPX1.VDD 13.78,32.88 13.4,32.5 R261.2 | R224.1 28.31,41.24 R264.1 28.25,42.95 26.9,44.3 v26,44.3 | v26,44.3 23.04,47.26 R232.2
  Bottom 0.61: 53.23,25.16 C222.1 | R220.2 R221.2 | 31.88,25.7 16.9,25.7 14.9,27.7 14.9,31.2 14.65,31.45 R261.2 C263.1
  Bottom 0.813: R230.1 53.23,28.08 52.19,27.04 50.44,27.04 48.91,28.57 FX61402.16 45.88,23.89 49.9,19.86 | 47.4,13.1 35.1,13.1 31.88,16.32 31.88,25.7 31.88,26.98 29.66,29.2 29.66,31.09 R220.2
  Bottom 1.016: C227.1 82.71,38 TX301A.P$8
  Bottom 1.27: 49.9,19.86 50.5,19.26 50.5,15.25 48.35,13.1 47.76,13.1 | R227.1 R228.1 53.6,33.27 53.6,29.09 R230.1 53.23,25.16
  Bottom 1.676: T222.D 49.23,11.27 47.4,13.1
  Bottom 2.54: FM+5V.1 44.64,13.1 47.4,13.1 47.76,13.1
FX_CLK(RX)
  Top 0.406: 12.4,62.23 12.47,62.23 14.45,60.25 14.45,58.5 15.7,57.25 15.7,56.65 17.3,55.05 HCONC.A6 | 12.4,62.23 R210.1 | 12.4,62.23 13.87,63.7 26.15,63.7 27.6,65.15 33.65,65.15 34.1,65.6 34.1,66.85 FX61401.12
FX_CLK(TX)
  Bottom 0.406: HCONC.A13 27.12,47.17 33.66,40.64 39.37,40.64 41.91,38.1 41.91,35.56 43.81,33.66 FX61402.12
  Bottom 0.61: FX61402.12 51.52,33.66 R228.2
FX_DET(RX)  (via drill 0.6)
  Top 0.406: v8.55,70.55 v8.56,70.56 R211.2 13.54,70.55 35.05,70.55 36.6,69 FX61401.14 36.65,66.84 36.65,65.5 36,64.85 35.65,64.85 34.45,63.65 28.15,63.65 26.65,62.15 25,62.15 24.6,61.75 24.6,58.55 23.35,57.3 23.35,56.7 21.7,55.05 HCONC.A8
  Bottom 0.406: DET.1 16.28,82.48 14.3,80.5 9.95,80.5 6.5,77.05 6.5,72.15 8.1,70.55 v8.55,70.55
FX_M0(RX)  (via drill 0.6)
  Top 0.406: R208.2 11.74,46.12 13.94,46.12 16.66,48.84 20.82,48.84 22.05,50.06 HCONC.A9 | FX61401.3 36.6,74.64 37.55,73.7 40.1,73.7 41.15,72.65 v41.15,68.15 | v41.15,64.35 41.15,63.55 37.25,59.65 37.25,58.45 36,57.2 36,56.6 34.75,55.35 34.75,54.7 36.05,53.4 36.05,52.6 37.8,50.85 v39.4,50.85
  Bottom 0.406: v41.15,64.35 v41.15,68.15 | v39.4,50.85 39.4,52 38.55,52.85 38.55,53.5 37.6,54.45 37.05,54.45 36.2,53.6 35.85,53.6 34.75,54.7 34.75,55.4 33.7,56.45 33.25,56.45 32.4,55.6 31.95,55.6 31.1,56.45 30.7,56.45 29.75,55.5 29.5,55.5 28.6,56.4 28.15,56.4 27.4,55.65 26.9,55.65 26.1,56.45 25.55,56.45 24.55,55.45 24.55,54.7 23,53.15 HCONC.A9
FX_M1(TX)  (via drill 0.6)
  Top 0.406: v29.66,48.38 29.66,35.74 v29.72,35.68
  Bottom 0.406: HCONC.A15 v29.66,48.38 | v29.72,35.68 30.6,35.68 31.32,34.96 R221.1
  Bottom 0.61: FX61402.4 32.6,32.39 R221.1
FX_RDYN(RX)
  Top 0.406: HCONC.A11 24.55,53.18 24.55,55.3 25.9,56.65 25.9,57.3 25.95,57.3 27.1,58.45 27.1,61.7 28.17,62.77 R209.1 35.3,62.9 36.45,62.9 37.9,64.35 37.9,66.87 FX61401.15
FX_RDYN(TX)
  Bottom 0.406: FX61402.15 50.41,29.84 R230.2 | 42.3,29.85 41.05,28.6 41.05,27.18 RDYN.1 | 42.3,29.85 FX61402.15 | HCONC.A12 25.86,46.65 33.35,39.15 38.4,39.15 40.85,36.7 40.85,31.3 42.3,29.85
  Bottom 0.61: FX61402.15
FX_RXD(RX)
  Top 0.406: RXD.1 12.47,66.47 15.56,69.56 R212.2 34.55,69.55 35.28,68.81 FX61401.13 35.35,66.88 35.35,65.45 34.35,64.45 28.05,64.45 26.45,62.85 23.4,62.85 22.05,61.5 22.05,58.55 20.75,57.25 20.75,56.6 19.5,55.35 HCONC.A7
FX_TXD(TX)
  Bottom 0.406: 40.01,41.91 43.18,38.73 43.18,35.56 43.81,34.92 FX61402.11 | 40.01,41.91 34.29,41.91 28.39,47.8 HCONC.A14 | FX_TXD.1 48.4,43.14 41.48,43.14 40.25,41.91 40.01,41.91
  Bottom 0.61: FX61402.11 50.35,34.92 R227.2
GND  (via drill 0.6)
  Top 0.406: v20.65,18.9 16.45,18.9 12.45,22.9 7.48,22.9 | 7.48,22.9 C205.2 8.63,23.18 C260.2 | 7.48,22.9 7.48,20.72 v9.05,19.15 | R211.1 7.46,68.86 6.5,67.9 6.5,64.75 7.45,63.8 11.9,63.8 16.05,67.95 17.71,67.95 R212.1 18.88,66.78 R213.2 23.38,65.19 C204.2 21.11,65.19 v21.1,65.2 | FX61401.8 30.25,77.25 v28.65,78.85 | 66.85,65.25 R214.1 66.81,67.09 65.74,68.16 OP201.4 | 54.6,74.45 C201.1 49.65,78.86 TEMPERATURE252.3 | R205.2 15.16,84.8 21.15,84.8 | 21.15,84.8 29.2,84.8 v30.85,83.15 30.85,81.95 32.25,80.55 33.45,80.55 35.15,82.25 52.9,82.25 54.6,80.55 54.6,74.45 | v56.05,17.55 56.05,15.45 53.9,13.3 | 34.4,13.3 51.55,13.3 | 51.55,13.3 53.9,13.3 | v25.25,11.4 27.15,13.3 34.4,13.3 | C203.2 v28.56,61.11 v28.55,61.1 | v20.9,82.35 21.15,82.6 21.15,84.8 | C202.1 45.62,74.48 46.4,73.7 46.4,69.5 48.65,67.25 50.65,67.25 51.5,68.1 51.5,68.3 | 54.6,74.45 53.6,73.45 52.45,73.45 51.5,72.5 51.5,68.3 | v5.25,39 5.25,29.41 RX301A.P$8 | v55.05,11.3 55.05,12.15 53.9,13.3 | v39.9,26.1 39.9,23.9 41.6,22.2 45.95,22.2 v48.9,25.15 51.85,28.1 | v65.9,31.95 65.9,41.9 67,43 76.3,43 79.3,40 TX301A.P$9 | 51.85,28.1 v51.85,30.65 | 51.85,28.1 53.55,29.8 v55.2,29.8 | v53.05,8.7 53.05,11.8 51.55,13.3 | HCONC.B2 6.59,58.86 3.9,61.55 v3.9,65.2 | v69.15,18.15 67.7,16.7 v67.7,13.55 | v34.4,9.45 34.4,13.3 | C265.2 51.55,68.35 51.5,68.3
  Top 0.61: C265.2 53.6,69.5 53.9,69.8 61.4,69.8 61.7,69.5 61.7,68.2 OP201.4
  Bottom 0.406: IC251.4 63.26,16.89 64.7,15.45 64.7,14.6 65.75,13.55 v67.7,13.55 67.7,8.9 72.7,3.9 | 72.7,3.9 TEMPERATURE251.3 | TEMPERATURE251.3 | 78.89,4.19 C251.2 78.95,12.75 | 78.89,4.19 78.6,3.9 TEMPERATURE251.3 | IC252.4 78.56,16.94 80.25,15.25 | R256.1 71.28,14.5 C252.2 v69.14,18.16 v69.15,18.15 | 66.5,22.9 66.5,22.89 C255.2 65.72,21.25 65.7,21.25 | 36.45,1.9 36.45,1.75 | 9.45,15.4 13.15,15.4 IC220.6 IC220.7 | 21.96,17.31 C225.2 | 21.96,17.31 20,15.35 IC220.3 | 7.5,21.7 5.2,24 RX301A.P$6 5.55,25.71 5.55,26.45 4,28 RX301A.P$8 | 7.5,21.7 10.5,21.7 C224.1 | 7.5,17.35 7.5,21.7 | 9.45,15.4 7.5,17.35 | 21.96,17.31 22.2,17.55 22,17.55 v20.65,18.9 | v9.05,19.15 9.05,18.9 7.5,17.35 | HCONC.A1 11.88,53.78 HCONC.A2 13.15,55.68 HCONC.B1 11.88,57.59 HCONC.B2 | C257.2 29.44,71.86 28.7,72.6 28.7,75.22 R260.1 28.65,75.28 v28.65,78.85 26.95,80.55 26.95,82.5 27.58,83.13 C259.2 30.83,83.13 v30.85,83.15 | IC253.4 33.24,76.39 31.9,75.05 31.9,72.03 C257.2 | C256.2 49.98,75.56 48.15,77.4 48.15,80.31 TEMPERATURE252.3 | RX301A.P$8 6.6,28 | R226.2 48.9,37.95 48.9,39.4 47.25,41.05 44.5,41.05 44.2,40.74 C223.1 | R254.1 55.33,18.27 v56.05,17.55 | v25.25,11.4 25.25,10.3 25.92,9.63 R235.2 | C220.1 40.04,21.56 43.3,18.3 43.3,17.05 42.4,16.15 | 42.4,16.15 34.7,16.15 33.6,17.25 33.6,18.98 C221.1 | 56.8,28.7 58.2,28.7 | 58.2,28.7 C226.2 62.65,28.7 v65.9,31.95 | 56.8,28.7 55,26.9 55,24.55 56.55,23 60.75,23 62.5,21.25 65.7,21.25 | v28.55,61.1 28.55,68.34 C257.2 | v20.9,82.35 16.8,78.25 16.8,69.5 v21.1,65.2 17.8,68.5 7.2,68.5 v3.9,65.2 | HCONC.A1 6.94,53.14 5.25,51.45 v5.25,39 | C253.2 55.78,10.57 v55.05,11.3 | 42.4,16.15 47.45,16.15 48.45,17.15 48.45,19.35 45.05,22.75 41.5,22.75 38.45,25.8 38.45,27.55
  Bottom 0.406: 38.45,27.55 38.45,36.9 37.88,37.47 FX61402.8 33.9,37.45 33.25,38.09 R223.2 | v39.9,26.1 38.45,27.55 | v48.9,25.15 C222.2 | R229.2 51.38,31.12 v51.85,30.65 | 65.7,21.25 66.5,22.05 66.5,22.9 | 66.5,22.9 67.4,23.8 75.95,23.8 77.95,21.8 79.1,21.8 79.6,21.3 80.7,21.3 81.45,20.55 81.45,16.45 80.25,15.25 | 80.25,15.25 80.25,13.1 79.9,12.75 78.95,12.75 | 78.95,12.75 78.9,12.7 78.9,4.2 78.89,4.19 | TEMPERATURE251.3 | 72.7,3.9 70.7,1.9 59.85,1.9 v53.05,8.7 | 9.45,15.4 7.1,13.05 7.1,4 9.9,1.2 35.75,1.2 36.45,1.9 | 56.8,28.7 55.7,29.8 v55.2,29.8 | T223.2 37.1,7.34 37.1,2.55 36.45,1.9 | C261.2 80.8,39.85 80.8,40 | C262.2 58.2,28.15 58.2,28.7 | R263.2 21.9,43.85 R262.2 21.75,44.95 21.6,45.1 20,45.1 19.7,45.4 19.7,47.4 19.2,47.9 12.9,47.9 11.88,48.91 HCONC.A1 | MPX1.GND2 18.57,33.52 16.8,35.3 16.8,39.7 16.48,40.02 MPX1.GND1 13.62,40.02 12.6,39 12.6,33.2 11.9,32.5 9.9,32.5 | 9.9,32.5 5.6,32.5 3.84,30.74 RX301A.P$8 | C263.2 10.15,29.75 9.7,30.2 9.7,32.3 9.9,32.5
  Bottom 0.61: v55.2,29.8 55,30 55,37.7 54.8,37.9 R226.2 | T223.2 36.78,8.72 36.05,9.45 v34.4,9.45
  Bottom 1.016: 82.33,39.83 82.16,40 80.8,40 TX301A.P$9
  Bottom 1.27: 82.33,39.83 C227.2
  pour Top (isolate 0.406, no thermals): 0,5 arc90 5,0 81,0 arc90 86,5 86,81 arc90 81,86 5,86 arc90 0,81
  pour Bottom (isolate 0.406, no thermals): 0,5 arc90 5,0 81,0 arc90 86,5 86,81 arc90 81,86 5,86 arc90 0,81
  pour Route2 (isolate 0.406, no thermals): 0,5 arc90 5,0 81,0 arc90 86,5 86,81 arc90 81,86 5,86 arc90 0,81
  pour Route15 (isolate 0.406, no thermals): 0,5 arc90 5,0 81,0 arc90 86,5 86,81 arc90 81,86 5,86 arc90 0,81
N$1
  Top 0.61: X201.1 49.65,68.97 C201.2 49.63,72.75 48.6,72.75 47.35,74 47.35,76 45.55,77.8 44.25,77.8 43.2,78.85 38.8,78.85 37.88,77.92 FX61401.2
N$2
  Top 0.61: X201.2 44.55,68.98 C202.2 44.53,72.8 43.4,72.8 42.75,73.45 42.75,74.85 41.51,76.09 FX61401.1
N$3
  Top 0.406: C204.1 FX61401.9
N$4  (via drill 0.6)  (1 unrouted)
  Top 0.406: v62.9,63.05 62.95,63.05 R214.2 65.03,65.22 63.36,66.89 OP201.3
  Bottom 0.406: RX301A.P$5 3.8,21.96 2.34,21.96 1.1,23.2 1.1,61.1 3.82,63.82 12.58,63.82 17,59.4 17,58.55 17.9,57.65 18.6,57.65 19.55,58.6 19.55,59.3 20.35,60.1 35.55,60.1 38.5,63.05 v62.9,63.05
N$6
  Bottom 0.406: FX61402.1 36.67,23.28 C220.2 39.49,23.26 41.1,21.65 44.85,21.65 46.1,20.4 46.1,17.94 X220.2
N$7
  Top 0.406: R206.2 22.75,80.64 | 22.75,80.64 30.95,80.64 32.8,78.8 FX61401.6 | RXFB.1 23.6,81.5 22.75,80.64
N$8
  Bottom 0.406: X220.1 38.49,17.91 37.4,19 35.28,19 C221.2 35.25,22.05 33.95,23.35 33.95,29 34.8,29.84 FX61402.2
N$9
  Top 0.61: R207.2 3.97,72.07 4.8,72.9 34.45,72.9 35.35,73.8 35.35,76.08 FX61401.4
N$10
  Bottom 0.406: R242.1 73.29,44
  Bottom 0.61: 73.29,44 TX301A.P$11
N$11
  Top 0.305: R203.1 4.13,41.75 3.81,41.43 1.91,41.43 1.27,40.8 1.27,16.51 1.78,16 RX301A.P$2
N$12
  Bottom 0.406: FX61402.7 36.65,36.22 33.94,36.22 33.06,37.1 29.5,37.1 28.75,36.36 R222.2
N$13
  Top 0.305: R202.1 5.71,41.59 4.92,40.8 2.22,40.8 1.91,40.48 1.91,18.41 2.32,18 RX301A.P$3
N$14
  Top 0.305: R201.1 7.3,41.12 6.51,40.32 | 6.51,40.32 | 6.51,40.32 6.35,40.16 2.7,40.16 2.54,40.01 2.54,20.32 2.86,20 3.68,20 RX301A.P$4
N$18
  Top 0.406: R240.1
  Top 0.61: R240.1 TX301A.P$7
N$19
  Bottom 0.406: R263.1 22.38,41.33 MPX1.A2
N$20
  Bottom 0.406: R243.1 73.27,46
  Bottom 0.61: 73.27,46 TX301A.P$12
N$21
  Bottom 0.406: R241.1 73.33,42
  Bottom 0.61: 73.33,42 TX301A.P$10
N$22
  Bottom 0.61: C223.2 45.88,39.72 FX61402.9
N$23
  Top 0.406: RXIN.1 2.39,71 2.38,70.96 | 2.38,70.96 2.38,51.33 R204.2 | 2.38,70.96 2.38,72.18 5.7,75.5 5.7,78.05 8.29,80.64 R206.1 | R206.1 R205.1 | R206.1 11.85,79.35 12.2,79 26.75,79 28.45,77.3 28.45,75.05 29.65,73.85 33.5,73.85 34.1,74.45 34.1,76.06 FX61401.5
N$24  (via drill 0.6)
  Top 0.406: v4.2,52.6 4.2,50.2 3.47,49.47 R204.1
  Route2 0.406: RX301A.P$1 2.6,14 2,14.6 2,51.9 3.1,53 3.8,53 v4.2,52.6
N$26
  Bottom 0.61: FX61402.10 R226.1
N$27
  Bottom 0.61: R220.1 FX61402.3
N$28
  Bottom 0.406: FX61402.14 R229.1
N$29
  Top 0.406: FX61401.10 31.52,67.62 31.5,67.65 31.5,68.15 31.15,68.5 21.79,68.5 R213.1
N$30
  Bottom 0.61: IC252.3 75.91,18.2 74.7,17 74.7,14.71 R255.1 74.74,13.84 73.7,12.8 R256.2
N$31
  Bottom 0.406: 35.81,72.99 IC253.3 | 35.81,72.99 36.95,71.85 38.01,71.85 R257.2 | C257.1 34.69,71.86 35.81,72.99
N$32
  Bottom 0.406: IC253.1 40.2,78.24 R258.2
N$33
  Bottom 0.406: IC253.8 40,79.95 40.35,79.95 40.36,79.94 R258.1
N$34
  Bottom 0.61: R257.1 42.87,71.82 46.7,75.65 46.7,80.3 TEMPERATURE252.2
N$35
  Bottom 0.61: R260.2 30.38,78 31.11,78.74 36.51,78.74 37.08,78.17 IC253.2 37.08,74.68 38,73.76 R259.2
N$36
  Bottom 0.406: R262.1 19.1,42.75 19.1,41 19.43,40.67 MPX1.A1
N$37
  Bottom 0.406: R264.2 24.3,41.3 23.7,40.7 23.1,40.7 22.9,40.5 22.9,39.7 22.57,39.38 MPX1.EN
N$38
  Bottom 0.406: R233.1 34.24,2.6 35.2,2.6 35.83,3.23 T223.3 32.98,5.46 T224.G
N$39
  Bottom 0.61: C224.2 12.6,17.9 IC220.8 14.6,17.9 15,17.5 15,11.1 21.2,4.9 T224.D
N$40
  Bottom 0.61: 26.25,14.4 27.62,13.02 27.62,11.83 R235.1 | 26.25,14.4 R234.1 | IC220.2 16.98,16.63 16.35,16 16.35,13.35 16.75,12.95 24.8,12.95 26.25,14.4
N$43
  Top 0.406: CWKEY.1 73.55,23.3 R236.1
  Top 0.61: R236.1 76.97,24.33 77.3,24 TX301A.P$1
N$45
  Top 0.61: R237.1 76.26,28.44 76.7,28 TX301A.P$3
N$47
  Top 0.61: R238.1 76.56,32.34 78.9,30 TX301A.P$4
N$49
  Top 0.406: R239.1 83.23,28.4
  Top 0.61: R239.1 82.38,28.43 81.9,28.9 81.9,31.6 81.5,32 TX301A.P$5
N$51  (via drill 0.6)
  Top 0.813: v56.71,25.9 54.5,23.99 54.5,18.18 51.1,14.78 28.98,14.78 v26.48,17.28
  Bottom 0.406: C262.1 58.1,26.15 58.1,25.9
  Bottom 0.61: IC220.1 18.39,20.94 CW+VB.1
  Bottom 0.813: TX301A.P$2 79.2,25.9 C226.1 58.1,25.9 v56.71,25.9 | v26.48,17.28 26.45,17.31 C225.1 | C225.1 24.2,17.28 R234.2 | C225.1 24.17,18.73 21.8,21.1 19,21.1 CW+VB.1
N$55
  Bottom 0.61: IC251.3 60.64,18.14 61.4,18.9 65.18,18.9 C252.1 65.99,18.09 R251.2
N$56
  Bottom 0.61: IC251.1 58.1,16.19 56.83,14.92 55.14,14.92 R252.2
N$57
  Bottom 0.61: IC251.8 58.1,13.02 57.47,13.65 55.14,13.65 R252.1
N$58
  Bottom 0.61: TEMPERATURE251.2 72.4,5.4 68.8,9 68.8,14.7 68.15,15.35 R251.1
N$59
  Bottom 0.61: R254.2 R253.2 59.37,20.29 IC251.2
P_MAIN  (via drill 0.6)
  Top 0.61: v78.7,14.65 79.25,15.2 79.25,20.35 | 79.25,20.35 79.6,20.7 82.85,20.7 v83.5,21.35 | v75.65,22.45 77.15,22.45 79.25,20.35
  Route15 0.61: v83.5,21.35 83.5,46.6 81.65,48.45 v80.5,48.45
  Bottom 0.406: C251.1 77.19,11.46 77.8,10.85 TEMPERATURE251.1
  Bottom 0.61: 65.96,20.29 R253.1 61.06,21.46 60.46,22.06 54.86,22.06 53.82,21.02 53.82,9.73 54.7,8.85 56.66,8.85 C253.1 56.69,8.85 58.7,8.85 59.37,9.52 IC251.7 | 65.96,20.29 66.47,20.29 C255.1 | 65.96,20.29 65.99,20.32 68.86,20.32 69.7,19.48 IC252.7 73.47,19.48 74.9,20.9 74.9,21.7 v75.65,22.45 | R255.2 76.66,14.9 | R255.2 76.44,13.5 C251.1 | HCONC.A45 67.77,52.44 71.75,48.45 v80.5,48.45 83.05,48.45 84.55,49.95 84.55,66.95 79.9,71.6 62.85,71.6 58.88,75.56 C256.1 53.44,75.68 53.44,80.51 51.75,82.2 45.4,82.2 45.15,81.95 | v78.7,14.65 76.47,14.65 R255.2 | C259.1 31.92,81.43 33.65,79.7 36.6,79.7 37.05,80.15 37.05,81.56 IC253.7 37.08,82.93 37.95,83.8 43.55,83.8 45.15,82.2 45.15,81.95 | R259.1 41.02,75.4 43.45,75.4 45.17,77.12 TEMPERATURE252.1 45.15,80.35 45.15,81.95
POWER_CW  (via drill 0.6)
  Top 1.016: v58.68,49.86 58.68,9.36 56.72,7.4 31,7.4 v29.5,8.9
  Bottom 0.406: R233.2 31.85,4.25 31.25,3.65 T224.S
  Bottom 0.61: R245.1 29.5,10.8 v29.5,8.9
  Bottom 1.016: HCONC.A37 58.68,52.07 v58.68,49.86 | T224.S 29,2.6 28.6,3 28.6,8.4 29.1,8.9 v29.5,8.9
POWER_FM  (via drill 1)
  Route15 1.676: HCONC.A39 60.15,51.26 61.7,49.7
  Route15 2.54: 61.7,44.95 61.7,49.7 | 61.7,44.95 53.25,36.5 42.45,36.5 35.35,29.4 35.35,16.85 38.05,14.15 45.45,14.15 46.55,13.05 46.55,10.75 43.4,7.6 v43.4,5.6 | HCONC.A49 72.84,40.15 70.4,37.7 64.75,37.7 61.7,40.75 61.7,44.95
  Bottom 1.27: T222.S 42.75,6.25 v43.4,5.6
POWER_RX  (via drill 1)
  Top 0.406: 23.81,49.85 23.69,49.85 20.3,46.46 20.3,43.62 20.28,43.6 | 35.29,61.11 R209.2 35.86,61.07 40.41,65.62 | C203.1 31.9,59.35 32.25,59 32.25,58.6 30.9,57.25 30.9,56.7 32.2,55.4 32.2,54.8 30.95,53.55 30.95,50.6 30.2,49.85 | C260.1 9.62,26.04 7.79,26.04
  Top 0.61: 5.4,66.34 R207.1 | 5.4,66.34 5.4,70.55 6.55,71.7 36.2,71.7 39.15,68.75 FX61401.16 40.41,65.62 53.8,65.62 | C203.1 35.29,61.11 | R210.2 7.47,62.23 5.4,64.3 5.4,66.34 | R208.1 11.73,43.62 12.45,42.9 19.32,42.9 20.32,43.9 | 53.8,65.62 OP201.7 | C265.1 53.6,65.82 53.8,65.62
  Top 1.016: 20.32,43.9 20.32,46.35 23.81,49.85 30.2,49.85 30.48,49.85 32.07,48.26 43.09,48.26 v44.5,49.66 | 7.79,26.04 C205.1
  Top 1.676: 7.79,26.04 7.75,26 RX301A.P$7
  Route2 1.676: 8.91,25.98 8.9,26 RX301A.P$7 | 62.69,52.25 HCONC.A41
  Route2 2.54: 62.69,52.25 61.9,51.47 61.9,48.2 60,46.3 48.31,46.3 v44.5,49.66 44.45,49.55 35.4,40.5 28.15,40.5 22.1,34.45 22.1,28.45 21.05,27.4 16,27.4 13.55,24.95 9.95,24.95 8.91,25.98
REF25  (via drill 0.6)
  Top 0.61: 84.8,12.9 83.5,11.6 81.1,11.6 80,10.5 80,2.3 79.3,1.6 63.25,1.6 61.9,2.95 v61.9,5.75 | 84.8,12.9 84.8,60.93 83.5,62.23 79.06,62.23 78.3,62.99 78.3,81.5 75.95,83.85 33.15,83.85 32.6,83.3 v32.6,82.55 | v80.5,19.4 80.5,17.2 84.8,12.9
  Bottom 0.61: IC252.6 73.93,18.2 75.2,19.48 IC252.2 77.35,19.4 v80.5,19.4 | v61.9,5.75 61.9,11.68 IC251.5 | IC253.5 33.56,81.59 v32.6,82.55
RSSI
  Top 0.406: HCONC.A21 37.28,55.34 38.55,56.6 38.55,57.25 39.85,58.55 39.85,60 41.7,61.85 57.65,61.85 58.3,62.5 58.3,65.6 | 58.3,65.6 58.3,66.5 57.91,66.89 OP201.6 | OP201.2 61.72,65.6 58.3,65.6
RX_CLK
  Top 0.305: R203.2 4.13,48.58 7.3,51.75 13.97,51.75 14.43,52.21 HCONC.A3
RX_DAT
  Top 0.305: R202.2 5.71,48.1 7.94,50.32 13.81,50.32 15.7,52.21 HCONC.A4
RX_STB
  Top 0.305: R201.2 7.3,47.47 9.37,49.53 14.45,49.53 16.96,52.05 HCONC.A5
TEMP_CWFMTX[HUB]
  Bottom 0.406: IC253.6 35.88,81.66 35.88,83.82 35.24,84.45 27.62,84.45 25.72,82.55 25.72,75.25 26.99,73.98 26.99,65.56 27.78,64.77 27.78,62.64 27.15,62.01 20,62.01 18.23,60.24 HCONC.B6
TEMP_FMRX[HUB]  (via drill 0.6)
  Top 0.61: v24.13,47.62 24.13,45.53 22.54,43.94 22.54,12.76 23.5,11.8 23.5,7.4 27.9,3 59.87,3 v60.64,3.77
  Bottom 0.406: HCONC.B8 20.77,56.67 22.05,55.4 22.05,54.8 20.8,53.55 20.8,50.95 v24.13,47.62
  Bottom 0.61: v60.64,3.77 IC251.6

### Text on the board
tNames: INVADER | COMMUNICATIONBOARD:EM | GND | RX
bNames: TX | CW_KEY